# Altium schematic sheet Inputs.SchDoc: External Inputs
size 297 x 209 mm; DocumentNumber: SP-0334; SheetNumber: 4; SheetTotal: 5
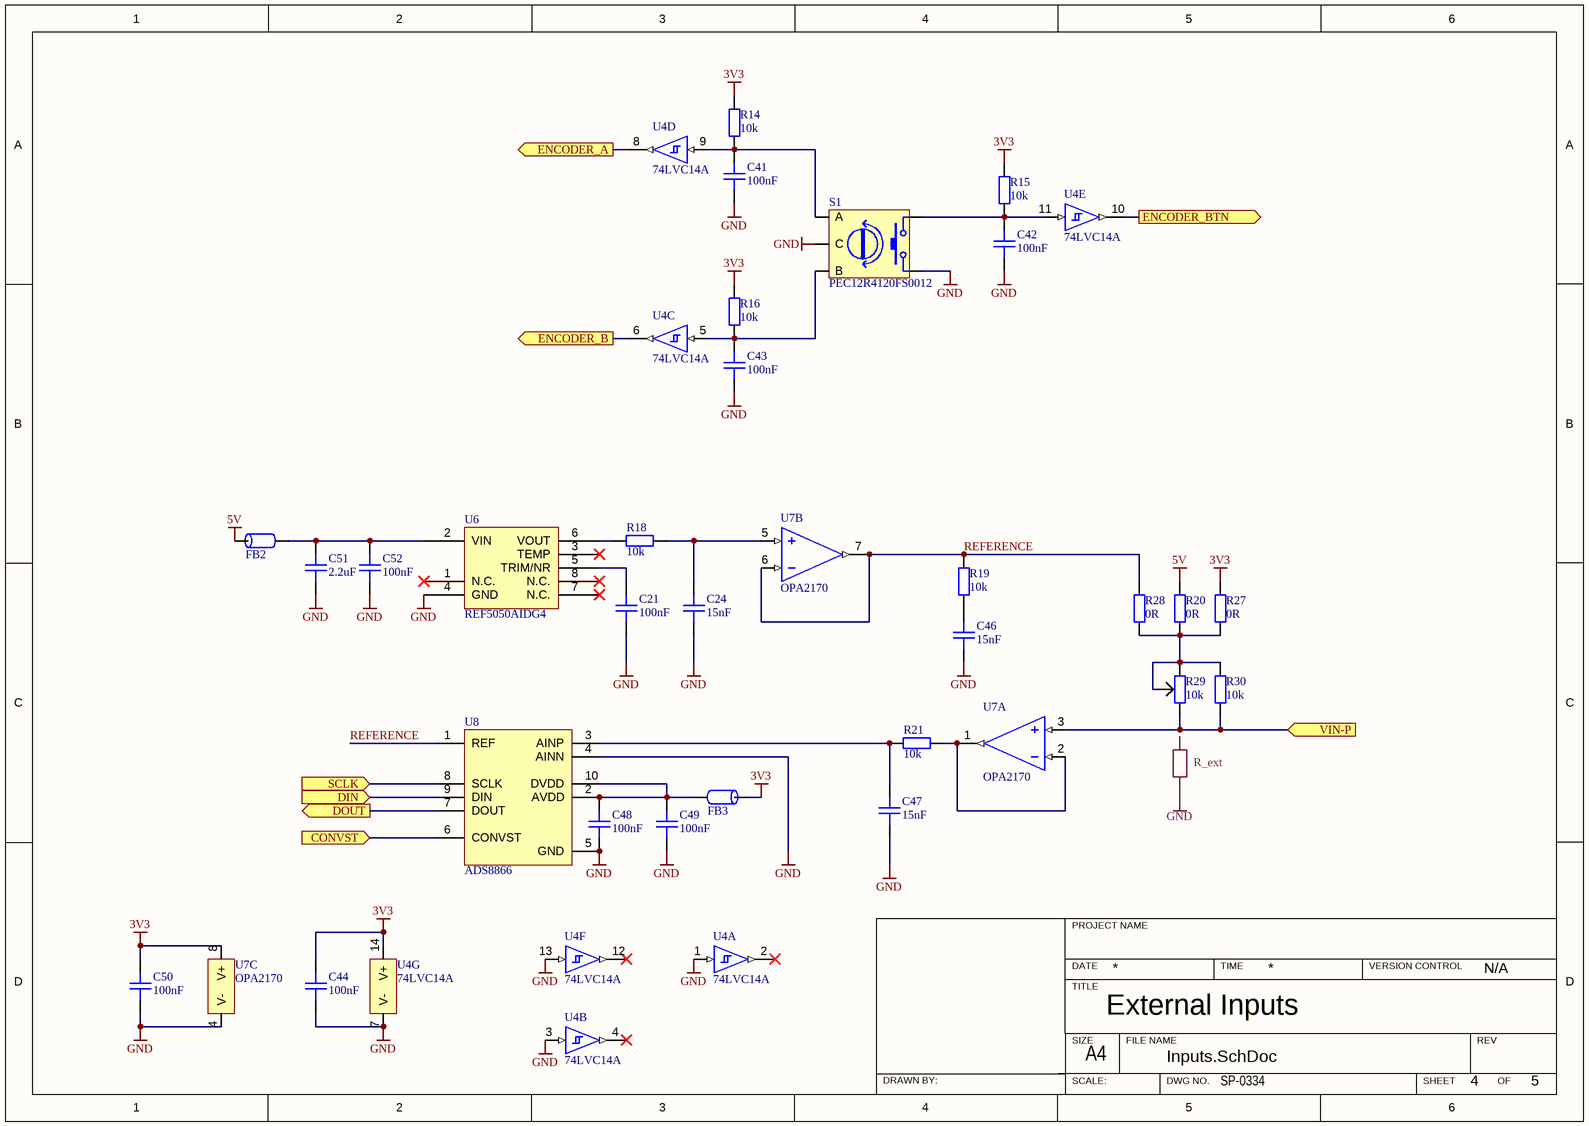
[diagram p0: Inputs.SchDoc]

## Parts
C21  100nF  [CAP-0603]
C24  15nF  [CAP-0603]
C41  100nF  [CAP-0603]
C42  100nF  [CAP-0603]
C43  100nF  [CAP-0603]
C44  100nF  [CAP-0603]
C46  15nF  [CAP-0603]
C47  15nF  [CAP-0603]
C48  100nF  [CAP-0603]
C49  100nF  [CAP-0603]
C50  100nF  [CAP-0603]
C51  2.2uF  [CAP-0805]
C52  100nF  [CAP-0603]
FB2  FB - 0603  [FB-0603]  (value not drawn)
FB3  FB - 0603  [FB-0603]  (value not drawn)
R14  10k  [RES-0603]
R15  10k  [RES-0603]
R16  10k  [RES-0603]
R18  10k  [RES-0603]
R19  10k  [RES-0603]
R20  0R  [RES-0603]
R21  10k  [RES-0603]
R27  0R  [RES-0603]
R28  0R  [RES-0603]
R29  10k  [RES-TRIM-SMD]
R30  10k  [RES-0603]
S1  PEC12R4120FS0012  [BTN-ENCODER-12pos]
U4  74LVC14A  [IC-SOIC-14]  (parts A,B,C,D,E,F,G of 7)
U6  REF5050AIDG4  [IC-SOIC-8]
U7  OPA2170  [IC-SOIC-8]  (parts A,B,C of 3)
U8  ADS8866  [IC-VSSOP-10]

## Ports
CONVST (in), DIN (in), DOUT (out), ENCODER_A (out), ENCODER_B (out), ENCODER_BTN (out), SCLK (in), VIN-P (in)

## Nets
3V3: C44.2 C50.2 FB3.1 R14.1 R15.1 R16.1 R27.2 U4.14(V+) U7.8(V+)
5V: FB2.1 R20.2
GND: C21.1 C24.1 C41.1 C42.1 C43.1 C44.1 C46.1 C47.1 C48.1 C49.1 C50.1 C51.1 C52.1 S1.2(C) S1.5 U4.1(A) U4.3(A) U4.7(V-) U4.13(A) U6.4(GND) U7.4(V-) U8.4(AINN) U8.5(GND)
CONVST: U8.6(CONVST) ; port CONVST
DIN: U8.9(DIN) ; port DIN
DOUT: U8.7(DOUT) ; port DOUT
ENCODER_A: U4.8(Y) ; port ENCODER_A
ENCODER_B: U4.6(Y) ; port ENCODER_B
ENCODER_BTN: U4.10(Y) ; port ENCODER_BTN
REFERENCE: R19.2 R28.2 U7.6(IN-) U7.7(OUT) U8.1(REF)
SCLK: U8.8(SCLK) ; port SCLK
VIN-P: R29.3 R30.1 U7.3(IN+) ; port VIN-P
NetC21_2: C21.2 U6.5(TRIM/NR)
NetC24_2: C24.2 R18.2 U7.5(IN+)
NetC41_2: C41.2 R14.2 S1.1(A) U4.9(A)
NetC42_2: C42.2 R15.2 S1.4 U4.11(A)
NetC43_2: C43.2 R16.2 S1.3(B) U4.5(A)
NetC46_2: C46.2 R19.1
NetC47_2: C47.2 R21.1 U8.3(AINP)
NetC48_2: C48.2 C49.2 FB3.2 U8.2(AVDD) U8.10(DVDD)
NetC51_2: C51.2 C52.2 FB2.2 U6.2(VIN)
NetR18_1: R18.1 U6.6(VOUT)
NetR20_1: R20.1 R27.1 R28.1 R29.1 R29.2 R30.2
NetR21_2: R21.2 U7.1(OUT) U7.2(IN-)

Not connected (* = marked no-connect by the designer): U4 2(Y)* 4(Y)* 12(Y)*; U6 1(N.C.)* 3(TEMP)* 7(N.C.)* 8(N.C.)*

## Notes on the sheet
- R_ext
- GND
- PROJECT NAME
- DATE
- TITLE
- TIME
- VERSION CONTROL
- N/A
- SIZE
- SCALE:
- A4
- FILE NAME
- DWG NO.
- SHEET
- REV
- OF
- DRAWN BY:

## Library data of the parts
C21 C24 C41-C44 C46-C50 C52 = CAP - 0603: Capacitor Non-Polar
  C21 C41-C44 C48-C50 C52: Value: 100nF; Distributor: *; Order number: *
  C24 C46: Value: 15nF; Distributor: *; Order number: *
  C47: Value: 15nF; Distributor: Lomex; Order number: 82-15-10
C51 = CAP - 0805: Capacitor Non-Polar; Value: 2.2uF; Distributor: *; Order number: *
FB2 FB3 = FB - 0603: Ferrit bead 0603; Distributor: Lomex; Order Number: *
R14-R16 R18-R21 R27 R28 R30 = RES - 0603: Resistor
  R14-R16 R18 R19: Value: 10k; Distributor: *; Order number: *
  R20 R27 R28: Value: 0R; Distributor: Lomex; Order number: 80-11-68
  R21 R30: Value: 10k; Distributor: Lomex; Order number: 80-11-68
R29 = RES - POT - TRIM - SMD: Trim Potentiometer; Order number: 4014863; Distributor: Farnell; Value: 10k; Supplier 1: RSComponents; Supplier Part Number 1: 6696691P
S1 = BTN - Encoder 12pos: Encoder with Push Button; Order number: 100.387.49; ComponentLink1Description: DataSheet; Distributor: Hestore
U4 = IC - 74LVC14: 6xINVERTING GATE SCHMITT-TRIGGER SO-14; ComponentLink1Description: DataSheet; Distributor: Lomex; Order number: 87-04-56; Value: 74LVC14A
U6 = IC - REF5050: Enhanced Product Low-Noise, Very Low Drift, Precision Voltage Reference, 5V; Order number: 100.386.03; Distributor: Hestore; Supplier 1: Mouser; Supplier Part Number 1: 595-REF5050AIDG4
U7 = IC - OPA2170: Low-Power, Dual-Operational Amplifiers; ComponentLink1Description: DataSheet; ComponentLink1URL: https://www.ti.com/lit/ds/symlink/opa2170.pdf?ts=1699036711414; Distributor: N/A; Order number: N/A; Value: OPA2170
U8 = IC - ADS8866: ADC; Order number: 595-ADS8866IDGS; Distributor: Mouser; Supplier 1: Mouser; Supplier Part Number 1: 595-ADS8866IDGSR